# Altium schematic sheet TE7300.SchDoc: DIPSY-STARTER
size A4; Organization: Trenz Electronic GmbH; DocumentNumber: 1; Revision: 01; SheetNumber: 1; SheetTotal: 1; Date: 08.07.2015; Author: Antti Lukats; CompanyName: Trenz Electronic GmbH; DrawnBy: Antti Lukats; Engineer: Antti Lukats; ProjectName: TE0723 Arduino
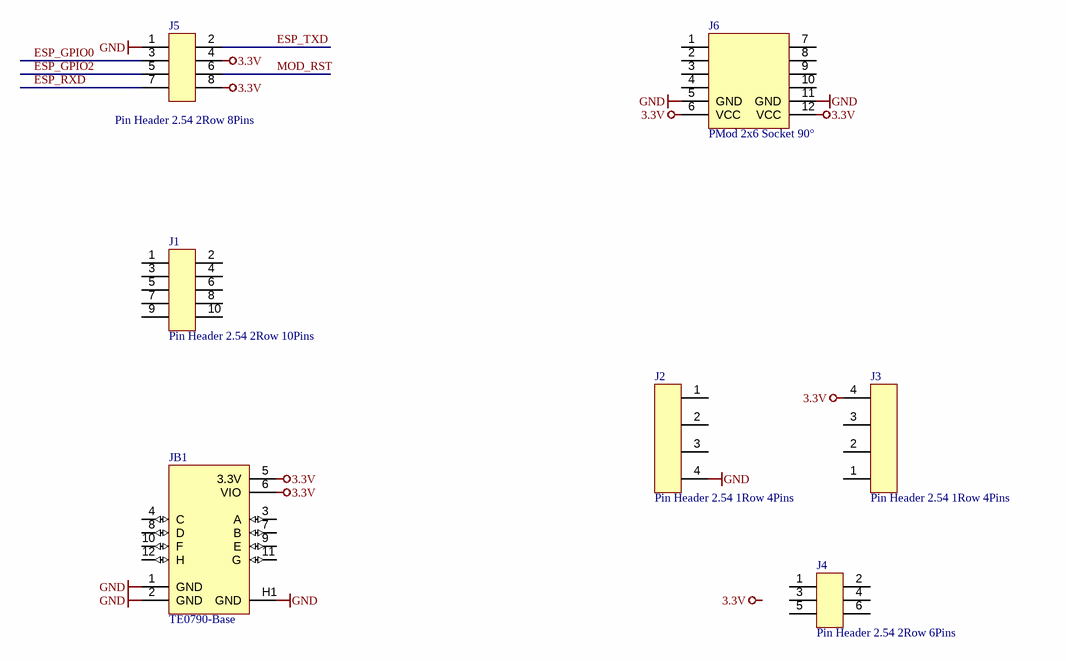
[diagram p0: TE7300.SchDoc]

## Parts
J1  Pin Header 2.54 2Row 10Pins  [STIFTLEISTE2_54 OG 2R-10]
J2  Pin Header 2.54 1Row 4Pins  [STIFTLEISTE2_54 OG 1R-4]
J3  Pin Header 2.54 1Row 4Pins  [STIFTLEISTE2_54 OG 1R-4]
J4  Pin Header 2.54 2Row 6Pins  [STIFTLEISTE2_54 OG 2R-6]
J5  Pin Header 2.54 2Row 8Pins  [STIFTLEISTE2_54 OG 2R-8]
J6  PMod 2x6 Socket 90°  [PMod2x6]
JB1  TE0790-Base  [TE0790-Base]

## Nets
3.3V: J3.4 J5.4 J5.8 J6.6(VCC) J6.12(VCC) JB1.5(3.3V) JB1.6(VIO)
GND: J2.4 J5.1 J6.5(GND) J6.11(GND) JB1.1(GND) JB1.2(GND) JB1.H1(GND)
ESP_GPIO0: J5.3
ESP_GPIO2: J5.5
ESP_RXD: J5.7
ESP_TXD: J5.2
MOD_RST: J5.6

Not connected (* = marked no-connect by the designer): J1 1 2 3 4 5 6 7 8 9 10; J2 1 2 3; J3 1 2 3; J4 1 2 3 4 5 6; J6 1 2 3 4 7 8 9 10; JB1 3(A) 4(C) 7(B) 8(D) 9(E) 10(F) 11(G) 12(H)

## Notes on the sheet
- Labels drawn without touching a wire or pin: 3.3V
- Title:
- Number:
- Rev.
- Date:
- A4
- Copyright:
- Page
- of
- Filename:

## Library data of the parts
J1 = 22402: Stiftleiste gerade 2-reihig, 10pol.; AN: 22402; Mixed: THT; Trenz-Stock: Yes
J2 J3 = 23162: Stiftleiste gerade 1-reihig, 4pol.; AN: 23162; Mixed: THT; Trenz-Stock: Yes
J4 = 22334: Stiftleiste gerade 2-reihig, 6pol.; AN: 22334; Mixed: THT; Trenz-Stock: Yes
J5 = 23904: Stiftleiste gerade 2-reihig, 8pol.; AN: 23904; Mixed: THT; Trenz-Stock: Yes
J6 = 25215: AN: 25215; Mixed: THT; Trenz-Stock: Yes; Trenz-Article-Number: 23185
JB1 = 26694: AN: 26694; Mixed: THT; Trenz-Article-Number: 22779